# EAGLE board CarPC-CC-Integrated (EAGLE 9.5.2)
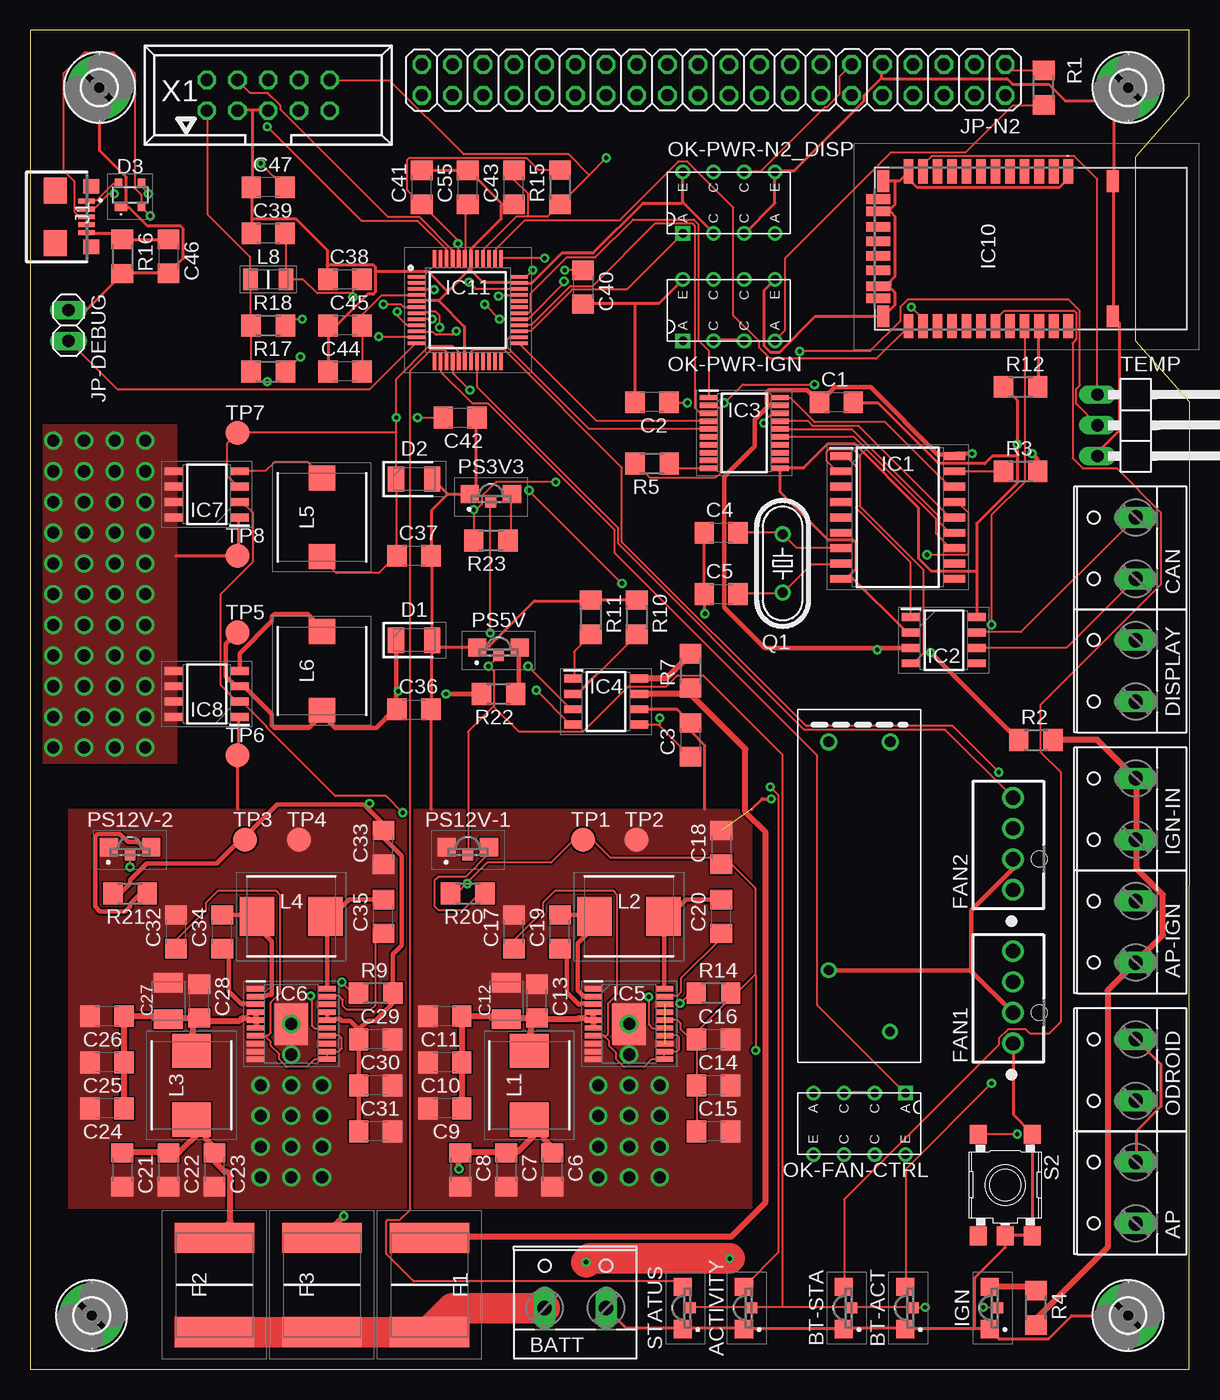
[diagram p6: board, top side]
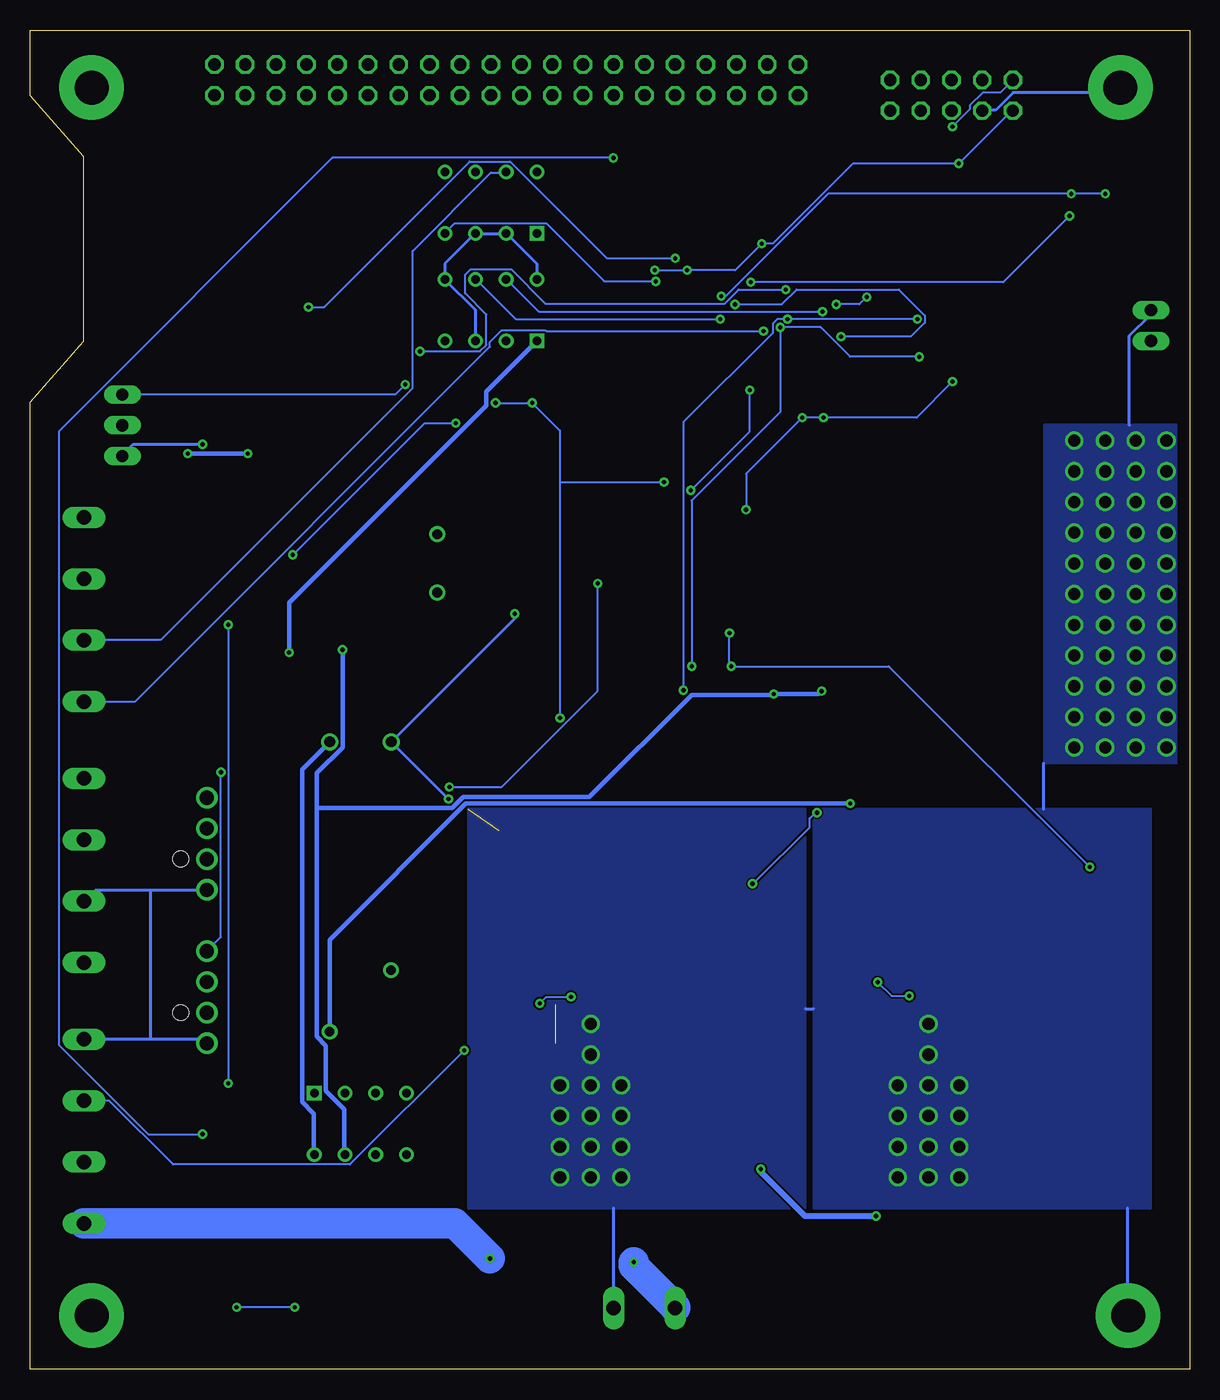
[diagram p7: board, bottom side, seen from below]

Size 95.89 x 110.8 mm. Coordinates in mm from the lower left corner, seen from the top.
Outline: 0,0 95.87,0 95.89,80.01 91.44,85.09 91.44,100.33 95.87,105.39 95.87,110.8 0,110.8 0,0
Copper layers (1*16): Top 0.035mm / dielectric 1.5mm / Bottom 0.035mm
Design rules "default": minimum track width 6mil, minimum drill 0.35mm, track to track 6mil, track to pad 6mil, pad to pad 6mil, via to via 6mil, smd to smd 6mil, copper to edge 40mil, drill to drill 6mil, minimum pad ring 10mil, minimum via ring 8mil, stop-mask expansion 4mil, vias tented up to drill 0mil, thermal gap 10mil
Net classes: 0 default: width 0.127 mm, clearance 0.025 mm; 1 5v Regulated: width 0.381 mm, clearance 0.025 mm; 2 12v Regulated: width 0.381 mm, clearance 0.127 mm; 3 11..14v Ignition: width 0.508 mm, clearance 0.127 mm; 4 11..14v Generator: width 0.508 mm, clearance 0.127 mm; 5 Chassis: width 0.254 mm; 6 0v Isolated: width 0.254 mm; 7 3V3 Arduino: width 0.076 mm, clearance 0.025 mm; 8 5V Signal: width 0.076 mm, clearance 0.025 mm; 9 3V3 Signal: width 0.076 mm, clearance 0.025 mm; 10 11..14v Unfused: width 2.54 mm, clearance 0.254 mm
tKeepout: area 20.3,33.7 to 22.9,41.3; area 48.3,33.7 to 50.8,41.3; area 20.3,68.6 to 27.9,72.4; area 20.3,55.9 to 27.9,59.7; area 69.9,97.2 to 71.1,99.7; area 69.9,85.7 to 71.1,88.3; area 88.9,97.2 to 90.2,99.7; area 88.9,85.7 to 90.2,88.3; area -1.9,50.2 to 12.1,78.1; area 9.5,22.2 to 17.1,24.8; area 37.5,22.2 to 45.1,24.8; area 10.8,4.4 to 37.5,9.5; 1 more areas
bKeepout: area 19.7,68.6 to 27.3,72.4; area 19.7,55.9 to 27.3,59.7; area 69.9,97.2 to 71.1,99.7; area 69.9,85.7 to 71.1,88.3; area 88.9,85.7 to 90.2,88.3; area 88.9,97.2 to 90.2,99.7; area -1.9,50.2 to 12.1,78.1; area 10.8,4.4 to 37.5,9.5; area 43.8,0.6 to 46.4,10.2
tRestrict: area 20.3,66 to 27.9,74.9; area 20.3,53.3 to 27.9,62.2; area -3.2,49.5 to 33.7,49.5; area -3.8,47.6 to 15.2,52.7; area -1.9,75.6 to 14.6,79.4

## Footprints (pad centres in the part's own frame; a part is rotated, then mirrored left to right if it is on the bottom)
INS126ASUW = smd 1.5 x 1.5: 1 -1.75,0.65; 2 1.75,0.65 | smd 0.9 x 0.9: 3 0,0
W237-132 = drill 1.194 long: 1 -2.54,-0.635; 2 2.54,-0.635
C1206 = smd 1.6 x 1.8: 1 -1.4,0; 2 1.4,0
SMC_B = smd 1.6 x 2.4: + -1.5,0; - 1.5,0
DIOC3419X116N = smd 1.35 x 2.1: 1 -1.5,0; 2 1.5,0
PESD2ETHAXR = smd 1 x 0.7: 1 -0.75,-1 | smd 0.6 x 0.7: 2 0.95,-1; 3 0.95,1; 4 -0.95,1
MFGSMF30036X2 = smd 2.5 x 6.6: 1 -3.9,0; 2 3.9,0
47053-1000 = drill 1.17 pad 1.77: 1 1.57,2.54; 2 4.11,2.54; 3 6.65,2.54; 4 9.19,2.54 | hole 1.3: 4.11,0.38
2,8-PAD = drill 2.8 pad 5.334: B2,8 0,0
SOIC127P1030X265-18N = smd 1.85 x 0.65: 1 -4.675,5.08; 2 -4.675,3.81; 3 -4.675,2.54; 4 -4.675,1.27; 5 -4.675,0; 6 -4.675,-1.27; 7 -4.675,-2.54; 8 -4.675,-3.81; 9 -4.675,-5.08; 10 4.675,-5.08; 11 4.675,-3.81; 12 4.675,-2.54; 13 4.675,-1.27; 14 4.675,0; 15 4.675,1.27; 16 4.675,2.54; 17 4.675,3.81; 18 4.675,5.08
SOIC127P600X175-8N = smd 1.528 x 0.65: 1 -2.711,1.905; 2 -2.711,0.635; 3 -2.711,-0.635; 4 -2.711,-1.905; 5 2.711,-1.905; 6 2.711,-0.635; 7 2.711,0.635; 8 2.711,1.905
SOP65P640X120-20N = smd 1.475 x 0.45: 1 -2.938,2.925; 2 -2.938,2.275; 3 -2.938,1.625; 4 -2.938,0.975; 5 -2.938,0.325; 6 -2.938,-0.325; 7 -2.938,-0.975; 8 -2.938,-1.625; 9 -2.938,-2.275; 10 -2.938,-2.925; 11 2.938,-2.925; 12 2.938,-2.275; 13 2.938,-1.625; 14 2.938,-0.975; 15 2.938,-0.325; 16 2.938,0.325; 17 2.938,0.975; 18 2.938,1.625; 19 2.938,2.275; 20 2.938,2.925
SOP65P640X120-21N = smd 1.475 x 0.45: 1 -2.938,2.925; 2 -2.938,2.275; 3 -2.938,1.625; 4 -2.938,0.975; 5 -2.938,0.325; 6 -2.938,-0.325; 7 -2.938,-0.975; 8 -2.938,-1.625; 9 -2.938,-2.275; 10 -2.938,-2.925; 11 2.938,-2.925; 12 2.938,-2.275; 13 2.938,-1.625; 14 2.938,-0.975; 15 2.938,-0.325; 16 2.938,0.325; 17 2.938,0.975; 18 2.938,1.625; 19 2.938,2.275; 20 2.938,2.925 | smd 2.75 x 3.43: 21 0,0
SOIC127P599X173-8N = smd 1.525 x 0.65: 1 -2.712,1.905; 2 -2.712,0.635; 3 -2.712,-0.635; 4 -2.712,-1.905; 5 2.712,-1.905; 6 2.712,-0.635; 7 2.712,0.635; 8 2.712,1.905
RN42HIDIRM = smd 2 x 0.8: 1 -6.4,16; 2 -6.4,14.8; 3 -6.4,13.6; 4 -6.4,12.4; 5 -6.4,11.2; 6 -6.4,10; 7 -6.4,8.8; 8 -6.4,7.6; 9 -6.4,6.4; 10 -6.4,5.2; 11 -6.4,4; 12 -6.4,2.8; 13 6.4,2.8; 14 6.4,4; 15 6.4,5.2; 16 6.4,6.4; 17 6.4,7.6; 18 6.4,8.8; 19 6.4,10; 20 6.4,11.2; 21 6.4,12.4; 22 6.4,13.6; 23 6.4,14.8; 24 6.4,16 | smd 0.8 x 2: 28 3.1,0.3; 29 -3.1,0.3; 30 4.1,0.3; 31 1.8,0.3; 32 0.6,0.3; 33 -0.6,0.3; 34 -1.8,0.3; 35 -4.1,0.3 | smd 1.8 x 1: 36 -5.6,0.7; 37 -5.6,19.7; 38 5.6,0.7; 39 5.6,19.7
QFP50P900X900X120-48N = smd 1.475 x 0.3: 1 -4.238,2.75; 2 -4.238,2.25; 3 -4.238,1.75; 4 -4.238,1.25; 5 -4.238,0.75; 6 -4.238,0.25; 7 -4.238,-0.25; 8 -4.238,-0.75; 9 -4.238,-1.25; 10 -4.238,-1.75; 11 -4.238,-2.25; 12 -4.238,-2.75; 25 4.238,-2.75; 26 4.238,-2.25; 27 4.238,-1.75; 28 4.238,-1.25; 29 4.238,-0.75; 30 4.238,-0.25; 31 4.238,0.25; 32 4.238,0.75; 33 4.238,1.25; 34 4.238,1.75; 35 4.238,2.25; 36 4.238,2.75 | smd 0.3 x 1.475: 13 -2.75,-4.238; 14 -2.25,-4.238; 15 -1.75,-4.238; 16 -1.25,-4.238; 17 -0.75,-4.238; 18 -0.25,-4.238; 19 0.25,-4.238; 20 0.75,-4.238; 21 1.25,-4.238; 22 1.75,-4.238; 23 2.25,-4.238; 24 2.75,-4.238; 37 2.75,4.238; 38 2.25,4.238; 39 1.75,4.238; 40 1.25,4.238; 41 0.75,4.238; 42 0.25,4.238; 43 -0.25,4.238; 44 -0.75,4.238; 45 -1.25,4.238; 46 -1.75,4.238; 47 -2.25,4.238; 48 -2.75,4.238
DX4R005HJ5 = smd 0.4 x 1.35: 1 2.41,-0.429; 2 3.06,-0.429; 3 3.71,-0.429; 4 4.36,-0.429; 5 5.01,-0.429 | smd 1.2 x 1.3: 6 6.21,-0.029; 7 1.21,-0.029 | smd 2.15 x 1.9: 8 1.535,-3.029; 9 5.885,-3.029
1X02 = drill 1.016 long: 1 -1.27,0; 2 1.27,0
2X20 = drill 1.016 octagon: 1 -24.13,-1.27; 2 -24.13,1.27; 3 -21.59,-1.27; 4 -21.59,1.27; 5 -19.05,-1.27; 6 -19.05,1.27; 7 -16.51,-1.27; 8 -16.51,1.27; 9 -13.97,-1.27; 10 -13.97,1.27; 11 -11.43,-1.27; 12 -11.43,1.27; 13 -8.89,-1.27; 14 -8.89,1.27; 15 -6.35,-1.27; 16 -6.35,1.27; 17 -3.81,-1.27; 18 -3.81,1.27; 19 -1.27,-1.27; 20 -1.27,1.27; 21 1.27,-1.27; 22 1.27,1.27; 23 3.81,-1.27; 24 3.81,1.27; 25 6.35,-1.27; 26 6.35,1.27; 27 8.89,-1.27; 28 8.89,1.27; 29 11.43,-1.27; 30 11.43,1.27; 31 13.97,-1.27; 32 13.97,1.27; 33 16.51,-1.27; 34 16.51,1.27; 35 19.05,-1.27; 36 19.05,1.27; 37 21.59,-1.27; 38 21.59,1.27; 39 24.13,-1.27; 40 24.13,1.27
INDM7366X300N = smd 2.85 x 3.2: 1 -2.85,0; 2 2.85,0
INDPM7373X500N = smd 2.05 x 2.2: 1 -3.25,0; 2 3.25,0
INDC3216X130N = smd 1.2 x 1.8: 1 -1.45,0; 2 1.45,0
FPR_ILD74 = drill 0.7 square: P$1 -2.54,5.08 | drill 0.7: P$2 -2.54,2.54; P$3 -2.54,0; P$4 -2.54,-2.54; P$5 2.54,-2.54; P$6 2.54,0; P$7 2.54,2.54; P$8 2.54,5.08
HC49/S = drill 0.813: 1 -2.413,0; 2 2.413,0
R1206 = smd 1.6 x 1.803: 1 -1.422,0; 2 1.422,0
SKHMPXE010 = smd 1.6 x 1.4: 1 -4.2,2.25; 2 4.2,2.25; 3 -4.2,-2.25; 4 4.2,-2.25; 5 4.2,0
1X03/90 = drill 1.016 long: 1 -2.54,-3.81; 2 0,-3.81; 3 2.54,-3.81
TP20R = smd 2 x 2: TP 0,0
FPR_JS-MN-KT = drill 0.9: A 18.9,5.08; B 18.9,0 | drill 0.8: COM -5.08,0; NO 0,5.08
057-010-1 = drill 1 octagon: 1 -5.08,-1.27; 2 -5.08,1.27; 3 -2.54,-1.27; 4 -2.54,1.27; 5 0,-1.27; 6 0,1.27; 7 2.54,-1.27; 8 2.54,1.27; 9 5.08,-1.27; 10 5.08,1.27

## Placement (x,y rotation side)
ACTIVITY  IN-S126ASUW  [INS126ASUW]  59.69,5.08 90 top
AP  [W237-132]  90.81,14.61 90 top
AP-IGN  [W237-132]  90.81,36.2 90 top
BATT  [W237-132]  45.09,5.71 0 top
BT-ACT  IN-S126ASUW  [INS126ASUW]  73.03,5.08 90 top
BT-STA  IN-S126ASUW  [INS126ASUW]  67.95,5.08 90 top
C1  100nF  [C1206]  66.68,80.01 0 top
C2  100nF  [C1206]  51.43,80.01 180 top
C3  100nF  [C1206]  54.61,52.07 270 top
C4  22pF  [C1206]  57.15,69.22 0 top
C5  22pF  [C1206]  57.15,64.14 0 top
C6  0.1µF  [C1206]  43.18,16.51 270 top
C7  10µF  [C1206]  39.37,16.51 270 top
C8  10µF  [C1206]  35.56,16.51 270 top
C9  10µF  [C1206]  34.29,21.59 180 top
C10  10µF  [C1206]  34.29,25.4 180 top
C11  0.1µF  [C1206]  34.29,29.21 180 top
C12  100µF  [SMC_B]  39.37,30.48 90 top
C13  0.47µF  [C1206]  41.91,30.48 90 top
C14  10µF  [C1206]  56.52,23.5 180 top
C15  10µF  [C1206]  56.52,19.69 180 top
C16  2.2µF  [C1206]  56.52,27.3 180 top
C17  4.7µF  [C1206]  40,36.2 90 top
C18  0.1µF  [C1206]  57.15,43.18 270 top
C19  0.1µF  [C1206]  43.81,36.2 90 top
C20  0.1µF  [C1206]  57.15,37.47 90 top
C21  0.1µF  [C1206]  7.62,16.51 270 top
C22  10µF  [C1206]  11.43,16.51 270 top
C23  10µF  [C1206]  15.24,16.51 270 top
C24  10µF  [C1206]  6.35,21.59 180 top
C25  10µF  [C1206]  6.35,25.4 180 top
C26  0.1µF  [C1206]  6.35,29.21 180 top
C27  100µF  [SMC_B]  11.43,30.48 90 top
C28  0.47µF  [C1206]  13.97,30.48 90 top
C29  10µF  [C1206]  28.58,27.3 180 top
C30  10µF  [C1206]  28.58,23.5 180 top
C31  2.2µF  [C1206]  28.58,19.69 180 top
C32  4.7µF  [C1206]  12.06,36.2 90 top
C33  0.1µF  [C1206]  29.21,43.18 90 top
C34  0.1µF  [C1206]  15.88,36.2 90 top
C35  0.1µF  [C1206]  29.21,37.47 90 top
C36  220µF  [C1206]  31.75,54.61 0 top
C37  220µF  [C1206]  31.75,67.31 0 top
C38  100nF  [C1206]  26.04,90.17 180 top
C39  10µF  [C1206]  19.69,93.98 180 top
C40  100nF  [C1206]  45.72,89.53 270 top
C41  100nF  [C1206]  32.38,97.79 90 top
C42  100nF  [C1206]  35.56,78.74 0 top
C43  100nF  [C1206]  40,97.79 90 top
C44  4.7µF  [C1206]  26.04,82.55 180 top
C45  100nF  [C1206]  26.04,86.36 180 top
C46  47nF 1kV  [C1206]  11.43,92.08 270 top
C47  10µF  [C1206]  19.69,97.79 180 top
C55  1µF  [C1206]  36.2,97.79 90 top
CAN  [W237-132]  90.81,67.95 90 top
D1  CD1206-B260  [DIOC3419X116N]  31.75,60.33 0 top
D2  CD1206-B260  [DIOC3419X116N]  31.75,73.66 0 top
D3  PRTR5V0U2AX,235  [PESD2ETHAXR]  8.26,97.16 0 top
DISPLAY  [W237-132]  90.81,57.78 90 top
F1  MF-GSMF300_36X-2  [MFGSMF30036X2]  33.02,6.99 270 top
F2  MF-GSMF300_36X-2  [MFGSMF30036X2]  15.24,6.99 90 top
F3  MF-GSMF300_36X-2  [MFGSMF30036X2]  24.13,6.99 90 top
FAN1  47053-1000  [47053-1000]  83.82,25.4 90 top
FAN2  47053-1000  [47053-1000]  83.82,38.1 90 top
H1  MOUNT-PAD-ROUND2.8  [2,8-PAD]  5.08,4.44 0 top
H2  MOUNT-PAD-ROUND2.8  [2,8-PAD]  90.81,4.44 0 top
H3  MOUNT-PAD-ROUND2.8  [2,8-PAD]  90.81,106.05 0 top
H4  MOUNT-PAD-ROUND2.8  [2,8-PAD]  5.71,106.05 0 top
IC1  MCP2515-I_SO  [SOIC127P1030X265-18N]  71.76,70.48 0 top
IC2  TJA1050T_CM,118  [SOIC127P600X175-8N]  75.57,60.33 0 top
IC3  TXS0108EPWR  [SOP65P640X120-20N]  59.05,77.47 0 top
IC4  INA219AIDR  [SOIC127P600X175-8N]  47.62,55.24 0 top
IC5  TPS55165QPWPRQ1  [SOP65P640X120-21N]  49.53,28.58 0 top
IC6  TPS55165QPWPRQ1  [SOP65P640X120-21N]  21.59,28.58 0 top
IC7  MIC4680-3.3YM  [SOIC127P599X173-8N]  14.61,72.39 180 top
IC8  MIC4680-5.0YM-TR  [SOIC127P599X173-8N]  14.61,55.88 180 top
IC10  RN42HID-I_RM  [RN42HIDIRM]  69.85,92.71 270 top
IC11  [QFP50P900X900X120-48N]  36.2,87.63 0 top
IGN  IN-S126ASUW  [INS126ASUW]  80.01,5.08 90 top
IGN-IN  [W237-132]  90.81,46.36 90 top
J1  DX4R005HJ5R2000  [DX4R005HJ5]  5.08,99.06 270 top
JP-DEBUG  [1X02]  3.17,86.36 270 top
JP-N2  [2X20]  56.52,106.68 180 top
L1  SRP7028A-2R2M  [INDM7366X300N]  41.27,23.5 90 top
L2  SRP7028A-4R7M  [INDM7366X300N]  49.53,37.47 0 top
L3  SRP7028A-2R2M  [INDM7366X300N]  13.33,23.5 90 top
L4  SRP7028A-4R7M  [INDM7366X300N]  21.59,37.47 0 top
L5  B1047AS-680M=P3  [INDPM7373X500N]  24.13,70.48 90 top
L6  B1047AS-680M=P3  [INDPM7373X500N]  24.13,57.78 90 top
L8  742792122  [INDC3216X130N]  19.69,90.17 0 top
ODROID  [W237-132]  90.81,24.77 90 top
OK-FAN-CTRL  ILD74  [FPR_ILD74]  67.31,20.32 270 top
OK-PWR-IGN  ILD74  [FPR_ILD74]  59.05,87.63 90 top
OK-PWR-N2_DISP  ILD74  [FPR_ILD74]  59.05,96.52 90 top
PS3V3  IN-S126ASUW  [INS126ASUW]  38.1,71.75 0 top
PS5V  IN-S126ASUW  [INS126ASUW]  38.73,59.06 0 top
PS12V-1  IN-S126ASUW  [INS126ASUW]  36.2,42.55 0 top
PS12V-2  IN-S126ASUW  [INS126ASUW]  8.26,42.55 0 top
Q1  16MHz  [HC49/S]  62.23,66.67 90 top
R1  1k  [R1206]  83.82,106.05 270 top
R2  1k  [R1206]  83.19,52.07 180 top
R3  10K  [R1206]  81.92,74.3 180 top
R4  1k  [R1206]  83.19,5.08 270 top
R5  10k  [R1206]  51.43,74.93 0 top
R7  100k  [R1206]  54.61,57.78 90 top
R9  100k  [R1206]  28.58,31.12 0 top
R10  10k  [R1206]  50.16,62.23 90 top
R11  10k  [R1206]  46.35,62.23 90 top
R12  10k  [R1206]  81.92,81.28 180 top
R14  100k  [R1206]  56.52,31.12 0 top
R15  100k  [R1206]  43.81,97.79 90 top
R16  1M  [R1206]  7.62,92.08 90 top
R17  4.7k  [R1206]  19.69,82.55 180 top
R18  4.7k  [R1206]  19.69,86.36 180 top
R20  1k  [R1206]  36.2,39.37 180 top
R21  1k  [R1206]  8.26,39.37 180 top
R22  330R  [R1206]  38.73,55.88 180 top
R23  270R  [R1206]  38.1,68.58 180 top
S2  SKHMPSE010  [SKHMPXE010]  80.65,15.24 270 top
STATUS  IN-S126ASUW  [INS126ASUW]  54.61,5.08 90 top
TEMP  [1X03/90]  92.08,78.11 270 top
TP1  TPTP20R  [TP20R]  45.72,43.81 0 top
TP2  TPTP20R  [TP20R]  50.16,43.81 0 top
TP3  TPTP20R  [TP20R]  17.78,43.81 0 top
TP4  TPTP20R  [TP20R]  22.23,43.81 0 top
TP5  TPTP20R  [TP20R]  17.15,60.96 0 top
TP6  TPTP20R  [TP20R]  17.15,50.8 0 top
TP7  TPTP20R  [TP20R]  17.15,77.47 0 top
TP8  TPTP20R  [TP20R]  17.15,67.31 0 top
U$4  JS-MN-KT  [FPR_JS-MN-KT]  71.12,33.02 90 top
X1  057-010-1  [057-010-1]  19.69,105.41 0 top

## Tracks (layer width: path | path; a pad name or v marks a point on that pad's centre or on a via)
0V
  Top 0.254: OK-FAN-CTRL.P$3 67.31,22.89 69.83,22.89 OK-FAN-CTRL.P$2
+3V3  (via drill 0.35)
  Top 0.152: IC7.3 17.25,73.03 16.56,73.71 16.48,73.71 16.26,73.94 16.26,76.61 17.09,77.45 TP7.TP 17.17,77.52 30.28,77.52 | 30.28,77.52 30.28,73.71 D2.1 30.28,73.64 30.28,67.31 | 30.28,77.52 v30.28,78.74 30.28,81.94 33.02,84.68 34.92,84.68 35.38,84.23 35.38,83.46 IC11.17 | v32.03,78.74 C42.1 | R23.2 36.68,68.61 v36.68,71.12 36.91,71.12 37.36,71.58 37.36,72.26 38.51,73.41 v43.46,73.41 | 30.28,67.31 28.83,65.86 25.32,65.86 24.18,67 24.18,67.23 L5.1 | 30.28,67.31 C37.1 | v41.55,90.93 41.02,90.4 40.49,90.4 IC11.36 | v44.22,90.93 45.67,90.93 C40.1 | IC11.44 35.38,91.92 v35.38,93.14 35.38,93.37 32.41,96.34 C41.1 32.33,96.42 31.19,97.56 31.19,100.08 31.34,100.23 41.02,100.23 42.01,99.24 43.76,99.24 R15.2 | 18.24,86.36 L8.1 18.16,90.17 18.16,92.08 14.66,95.58 14.66,104.11 X1.1 | 18.24,86.36 18.24,82.55 R17.2 18.31,82.55 19.15,81.71 v19.61,81.71 | 18.24,86.36 R18.2 | v19.08,99.77 21.06,97.79 C47.1 | TEMP.1 88.27,98.48 86.36,100.38 74.55,100.38 73.86,99.7 73.86,99.16 IC10.11 | 52.03,53.25 54.59,50.7 C3.2 | 52.03,53.25 51.99,53.29 50.39,53.29 IC4.5 | 56.98,79.54 57.1,79.43 57.1,74.17 56.72,73.79 51.23,73.79 50.09,74.93 R5.1 | 56.98,79.54 56.79,79.73 56.18,79.73 IC3.2 | v54.36,79.96 52.91,79.96 C2.1 | 56.98,79.54 v57.4,79.96 58.93,81.48 v64.87,81.48 | v52.07,53.9 52.07,53.29 52.03,53.25
  Bottom 0.152: v36.68,71.12 36.68,74.09 v32.03,78.74 v30.28,78.74 22.58,78.74 v19.61,81.71 | v44.22,90.93 v41.55,90.93 37.59,90.93 v35.38,93.14 34.47,93.14 27.84,99.77 v19.08,99.77 14.66,104.19 X1.1 | v57.4,79.96 v54.36,79.96 52.07,77.67 52.07,73.41 | 52.07,73.41 v52.07,53.9 | TEMP.1 65.71,80.64 v64.87,81.48 | 52.07,73.41 v43.46,73.41
+5V  (via drill 0.35)
  Top 0.381: TP5.TP 16.18,60 16.18,57.33 16.94,56.57 17.25,56.57 IC8.3 17.48,56.41 17.78,56.41 19.99,54.2 19.99,53.29 20.22,53.06 23.04,53.06 24.03,54.05 L6.1 24.18,54.51 24.18,54.13 25.25,53.06 28.6,53.06 30.12,54.59 C36.1 30.28,54.66 30.28,56.11 | 30.28,56.11 30.28,60.3 D1.1 | v34.39,55.88 R22.2 | v30.43,56.11 30.28,56.11 | v82.86,75.77 83.31,75.31 83.31,74.32 R3.1 | v77.9,75.77 76.61,75.77 76.45,75.62 IC1.18 76.3,75.69 75.08,75.69 69.52,81.25 66.55,81.25 65.41,80.11 C1.1 65.25,80.03 64.26,81.03 61.14,81.03 60.91,80.8 60.91,79.96 61.06,79.81 | 61.06,79.81 61.98,79.81 IC3.19 | 70.05,59.69 60.76,59.69 57.4,63.04 57.4,73.86 59.92,76.38 59.92,78.59 60.98,79.65 61.06,79.81 | 70.05,59.69 IC2.3 | v70.05,59.54 70.05,59.69
  Bottom 0.381: v30.43,56.11 30.66,55.88 v34.39,55.88 34.54,55.8 41.17,55.8 49.63,47.35 60.07,47.35 60.98,46.43 72.19,46.43 | v77.9,75.77 v82.86,75.77 | 72.19,46.43 72.19,49.33 70.05,51.46 v70.05,59.54 | 72.19,46.43 72.19,27.53 71.43,26.77 71.43,23.04 69.9,21.51 69.9,17.78 OK-FAN-CTRL.P$7
+12V/1  (via drill 0.35)
  Top 0.152: IC7.2 17.32,71.73 17.55,71.73 18.39,70.89 18.39,66.78 15.72,64.11 15.72,56.64 17.09,55.27 17.25,55.27 IC8.2 17.32,55.19 17.55,55.19 19.53,53.21 19.53,53.14 25.25,47.42 29.44,47.42 v30.81,46.05 | 36.11,40.22 37.82,41.94 43.08,41.94 44.91,43.76 45.67,43.76 TP1.TP 45.74,43.76 46.58,43.76 48.03,42.32 56.57,42.32 57.1,41.78 C18.2 57.17,41.71 58.09,41.71 59.99,39.8 59.99,32.72 59.96,32.68 | 36.11,40.22 35.31,39.42 34.85,39.42 R20.2 | C14.2 C15.2 | IC5.17 52.45,29.52 52.45,28.91 IC5.16 52.53,28.91 53.52,28.91 53.82,28.6 53.82,28.14 54.66,27.3 C16.2 | C16.2 C14.2 | C14.2 | 59.96,32.68 58.39,31.12 R14.2 57.86,31.12 57.86,30.66 55.12,27.91 C16.2 | v59.99,26.39 59.99,32.64 59.96,32.68 | v36.14,40.18 36.11,40.22
  Bottom 0.152: v59.99,26.39 69.44,16.94 84.07,16.94 89.33,22.2 91.39,22.2 ODROID.1 | v30.81,46.05 30.96,46.05 31.42,45.59 31.42,44.83 36.07,40.18 v36.14,40.18
+12V/2  (via drill 0.35)
  Top 0.381: C31.2 27.15,19.69 27.15,23.5 C30.2 27.15,23.65 27.15,27.15 C29.2 27.23,27.3 27.23,28.07 27.19,28.11 | IC6.17 24.56,29.52 24.56,28.91 IC6.16 24.71,28.91 25.17,28.91 25.25,28.98 25.63,28.98 25.78,28.83 26.47,28.83 27.19,28.11 | 27.19,28.11 27.92,28.83 28.52,28.83 29.97,30.28 29.97,31.12 R9.2 29.97,31.27 29.97,34.31 30.73,35.08 30.73,42.47 29.29,43.92 29.29,44.45 C33.2 29.21,45.14 27.8,46.55 | 27.8,46.55 27.61,46.74 20.45,46.74 17.78,44.07 TP3.TP 17.63,43.76 17.32,43.76 15.42,41.86 9.63,41.86 8.26,40.49 8.26,40.18 7.49,39.42 6.88,39.42 R21.2 | 27.8,46.55 v28.07,46.81
  Bottom 0.381: U$4.COM 71.12,35.54 59.84,46.81 v28.07,46.81
A0-DAC0/THERM-VO-SENS  (via drill 0.35)
  Top 0.152: v33.4,89.33 32.03,89.33 IC11.3 | v63.65,84.23 69.44,84.23 71.96,86.74 71.96,87.88 72.57,88.49 85.9,88.49 86.82,87.58 86.82,81.41 86.51,81.1 86.51,79.88 88.27,78.13 TEMP.2
  Bottom 0.152: v33.4,89.33 37.29,89.33 38.43,88.19 53.29,88.19 56.11,91.01 59.46,91.01 59.92,90.55 59.92,89.03 58.17,87.27 58.17,84.76 58.7,84.23 v63.65,84.23
A2/ACT-LED  (via drill 0.35)
  Top 0.152: v36.37,81.03 35,82.4 35,83.39 IC11.16 | v48.95,65.02 v41.25,72.72 | v61.21,48.18 61.9,47.5 61.9,9.7 59.08,6.88 ACTIVITY.2
  Bottom 0.152: v36.37,81.03 36.37,77.6 v41.25,72.72 | v48.95,65.02 48.95,56.11 56.87,48.18 v61.21,48.18
A3/STATUS-LED
  Top 0.152: IC11.15 34.39,83.46 34.39,84.23 34.24,84.38 33.17,84.38 31.42,82.63 31.42,13.21 30.58,12.37 29.59,12.37 29.44,12.22 29.44,9.55 31.73,7.26 53.52,7.26 53.9,6.88 STATUS.2
A4/SDA  (via drill 0.35)
  Top 0.152: v33.86,86.21 33.86,87.2 33.55,87.5 32.94,87.5 32.87,87.43 32.03,87.43 IC11.7 | v22.35,83.77 21.13,82.55 R17.1 | v41.17,58.17 44.68,54.66 44.91,54.66 IC4.3
  Bottom 0.152: v22.35,83.77 28.07,83.77 30.51,86.21 v33.86,86.21 33.86,79.2 41.17,71.88 v41.17,58.17
A5/SCL  (via drill 0.35)
  Top 0.152: v33.25,86.89 32.03,86.89 IC11.8 | v22.5,86.89 21.67,86.89 21.13,86.36 R18.1 | v41.86,56.19 44.68,53.37 44.91,53.37 IC4.4
  Bottom 0.152: v22.5,86.89 v33.25,86.89 34.09,86.89 34.47,86.51 34.47,85.75 41.86,78.36 v41.86,56.19
A6/FAN-RLS-CTRL
  Top 0.152: IC11.14 34.01,83.39 34.01,82.47 36.6,79.88 37.9,79.88 48.34,69.44 48.34,67.54 65.1,50.77 65.1,30.12 72.34,22.89 OK-FAN-CTRL.P$1
AREF
  Top 0.152: 27.46,86.36 27.46,87.27 29.06,88.88 IC11.4 | 27.46,86.36 27.46,82.55 C44.1 | 27.46,86.36 C45.1
BATT-F  (via drill 0.35)
  Top 0.508: C6.1 43.16,17.93 43.16,18.39 42.47,19.07 42.47,19.46 41.33,20.6 L1.1 42.01,19.69 40.34,18.01 39.57,18.01 C7.1 39.34,17.93 35.61,17.93 C8.1 35.46,17.7 v35.46,16.56 | v25.93,12.68 24.18,10.92 F3.2
  Bottom 0.508: v35.46,16.56 35.46,16.33 31.8,12.68 v25.93,12.68
BATT-F1
  Top 0.508: C21.1 7.64,17.93 11.38,17.93 C22.1 11.68,17.93 12.29,17.93 14.05,19.69 L3.1 13.36,20.6 14.5,19.46 14.5,19.07 15.19,18.39 15.19,17.93 C23.1 15.34,17.7 15.34,17.09 16.1,16.33 16.33,16.33 16.56,16.1 16.56,12.22 15.27,10.92 F2.2
BATT-IN  (via drill 0.35)
  Top 2.54: F2.1 15.27,3.07 24.11,3.07 F3.1 25.4,3.07 31.8,3.07 F1.2 33.02,3.15 34.92,5.05 42.54,5.05 BATT.1 | v57.86,9.17 46.28,9.17 v45.97,8.86
  Bottom 2.54: AP.1 60.76,12.07 v57.86,9.17 | v45.97,8.86 45.97,8.56 42.54,5.13 BATT.1
BATT-IN-FUSED
  Top 0.508: IC4.7 54.13,55.88 54.59,56.34 R7.1 54.51,55.96 59.16,51.31 59.16,46.13 60.83,44.45 60.83,13.82 58.01,11 33.1,11 33.02,10.92 F1.1
BST1
  Top 0.381: IC5.3 46.58,30.2 45.97,30.2 45.9,30.28 45.52,30.28 45.44,30.2 45.36,30.2 44.37,31.19 44.37,34.24 43.84,34.77 C19.1
BST1-2
  Top 0.381: IC6.3 18.62,30.2 18.01,30.2 17.93,30.28 17.55,30.28 17.48,30.2 16.41,31.27 16.41,34.24 15.88,34.77 C34.1
BST2
  Top 0.152: IC5.19 52.53,30.89 53.52,30.89 53.82,31.19 53.82,32.33 57.1,35.61 57.1,35.99 C20.1
BST2-2
  Top 0.152: IC6.19 24.56,30.89 25.55,30.89 25.86,30.58 25.86,30.05 26.16,29.74 28.14,29.74 28.52,30.12 28.52,35.31 29.21,35.99 C35.1
BT-ACTIVATE
  Top 0.254: R12.1 83.39,81.33 83.39,86.28 IC10.22
BT-LED-ACT  (via drill 0.35)
  Top 0.152: v79.5,23.65 72.42,16.56 72.42,6.88 BT-ACT.2 | v79.5,61.59 79.5,70.66 82.25,73.41 82.25,86.28 IC10.21
  Bottom 0.152: v79.5,61.59 v79.5,23.65
BT-LED-STA
  Top 0.152: BT-STA.2 67.31,6.88 67.31,14.05 80.11,26.85 80.11,27.38 80.87,28.14 82.32,28.14 82.7,27.76 84.23,27.76 85.22,28.75 85.22,49.4 83.54,51.08 83.54,54.97 93.52,64.95 93.52,70.89 89.87,74.55 87.05,74.55 86.21,75.39 86.21,84.91 86.51,85.22 86.51,87.43 86.36,87.58 80.57,87.58 79.88,86.89 79.88,86.36 IC10.19
BT-RX
  Top 0.152: IC11.38 38.51,91.92 38.51,92.69 40.87,95.05 48.72,95.05 53.59,99.92 54.36,99.92 58.17,96.11 58.17,87.2 60.3,85.06 60.3,84.53 61.21,83.62 69.98,83.62 72.64,86.28 IC10.13
BT-TX  (via drill 0.35)
  Top 0.152: v42.54,91.92 38.96,91.92 IC11.37 | v72.87,87.88 73.79,86.97 73.79,86.36 IC10.14
  Bottom 0.152: v42.54,91.92 48.18,91.92 56.18,99.92 59.54,99.92 71.58,87.88 v72.87,87.88
CAN-H
  Top 0.152: CAN.2 81.94,60.98 78.28,60.98 IC2.7
CAN-L
  Top 0.152: IC2.6 85.67,59.69 91.39,65.41 CAN.1
D4/SW-DEBUG
  Top 0.152: IC11.12 31.95,84.84 31.8,84.84 28.07,81.1 7.19,81.1 3.23,85.06 JP-DEBUG.2
D5/DISP-BRIGHT  (via drill 0.35)
  Top 0.152: v35.23,85.9 34.92,85.6 33.55,85.6 33.32,85.83 32.03,85.83 IC11.10
  Bottom 0.152: v35.23,85.9 53.21,85.9 53.29,85.98 56.87,85.98 57.86,84.99 57.86,84.61 87.2,55.27 91.39,55.27 DISPLAY.1
D6/IGN-SENS  (via drill 0.35)
  Top 0.152: v30.35,87.5 30.35,87.2 31.12,86.44 31.95,86.44 IC11.9
  Bottom 0.152: v30.35,87.5 53.82,87.5 56.49,90.17 OK-PWR-IGN.P$7
D7/ODROID-PWR-SENS  (via drill 0.35)
  Top 0.152: v28.83,85.45 31.95,85.45 IC11.11 | v38.81,86.89 v37.59,88.11
  Bottom 0.152: v28.83,85.45 23.04,85.45 21.9,86.59 21.9,87.2 24.03,89.33 32.49,89.33 33.71,88.11 v37.59,88.11 | v38.81,86.89 55.73,86.89 59,90.17 OK-PWR-IGN.P$6
D8/DISP-PWR-BTN-CTRL
  Top 0.152: OK-PWR-N2_DISP.P$1 49.33,89.33 44.83,89.33 41.4,85.9 40.49,85.9 IC11.27
D9/ODROID-PWR-BTN-CTRL  (via drill 0.35)
  Top 0.152: v44.14,90.02 44.14,89.86 41.17,86.89 40.49,86.89 IC11.29
  Bottom 0.152: v44.14,90.02 48.41,90.02 53.21,94.82 60.76,94.82 OK-PWR-N2_DISP.P$4
D10/SPI-CS-3V3
  Top 0.152: IC3.1 56.11,80.42 56.11,84.3 55.27,85.14 55.27,94.74 54.89,95.12 49.86,95.12 46.74,92 44.37,92 41.4,89.03 41.4,87.58 41.25,87.43 40.49,87.43 IC11.30
D11/SPI-MOSI-3V3
  Top 0.152: IC3.4 56.11,78.51 46.81,78.51 40.49,84.84 IC11.25
D12/SPI-MISO-3V3
  Top 0.152: IC3.3 56.11,79.12 55.42,79.12 54.97,79.58 54.97,94.59 54.74,94.82 51.69,94.82 46.51,89.64 44.68,89.64 41.48,86.44 40.49,86.44 IC11.28
D13/SPI-SCK-3V3
  Top 0.152: IC3.5 56.11,77.83 46.2,77.83 39.42,84.61 39.42,85.14 39.65,85.37 40.41,85.37 IC11.26
DISP-PWR-BTN
  Bottom 0.152: OK-PWR-N2_DISP.P$7 56.57,99.01 57.78,99.01 64.26,92.53 64.26,81.18 85.07,60.38 91.39,60.38 DISPLAY.2
FAN-12V
  Top 0.381: 77.75,33.02 U$4.NO | 77.75,33.02 81.26,29.52 FAN1.2 | FAN2.2 81.26,42.16 81.26,41.4 77.83,37.97 77.83,33.17 77.75,33.02
FAN-RLS-TRIG
  Bottom 0.381: OK-FAN-CTRL.P$8 72.42,17.78 72.42,21.13 73.41,22.12 73.41,49.63 U$4.B
FB-3V3
  Top 0.152: IC7.4 17.32,74.32 19.46,74.32 20.22,75.08 22.96,75.08 24.11,73.94 24.11,73.79 L5.2
FB-5V
  Top 0.381: IC8.4 17.32,59.23 19.99,61.9 19.99,62.28 20.22,62.51 22.96,62.51 24.11,61.37 24.11,61.06 L6.2
GND  (via drill 0.35, 1)  (2 unrouted)
  Top 0.254: AP.2 91.47,17.17 91.47,19.69 93.52,21.74 93.52,25.25 91.47,27.3 ODROID.2 | FAN1.1 81.33,26.92 81.33,21.06 82.86,19.53 S2.1 82.93,19.38 82.93,11.15 S2.2 82.86,11.07 80.65,11.07 S2.5 80.65,10.08 78.13,7.57 78.13,3.38 | 78.13,3.38 72.49,3.38 BT-ACT.1 72.34,3.38 67.31,3.38 BT-STA.1 67.23,3.38 59.16,3.38 ACTIVITY.1 59,3.38 53.98,3.38 STATUS.1 53.9,3.45 49.25,3.45 BATT.2 | 78.13,3.38 79.35,3.38 IGN.1 79.43,3.23 80.11,2.54 84.23,2.54 86.13,4.44 H2.B2,8 | IC2.2 72.8,60.98 72.49,60.98 67.84,65.63 IC1.9 67.46,65.41 68.3,66.24 68.3,68.38 68.07,68.61 66.02,68.61 62.05,72.57 62.05,74.47 IC3.11 62.13,74.55 63.96,74.55 65.94,76.53 68.22,76.53 73.48,71.27 73.48,67.08 74.55,66.02 78.28,66.02 | 78.28,66.02 78.28,69.98 81.64,73.33 81.64,75.54 | 78.28,66.02 78.28,62.28 IC2.8 | 81.64,75.54 v81.64,76.53 81.64,80.19 80.57,81.25 R12.2 | 81.64,75.54 79.58,75.54 78.97,74.93 75.16,74.93 70.13,79.96 68.15,79.96 C1.2 | TEMP.3 88.27,75.84 90.09,77.67 90.09,86.59 89.64,87.05 IC10.39 89.56,87.12 89.56,98.25 IC10.37 89.64,98.4 89.64,104.88 H3.B2,8 89.56,104.95 85.6,104.95 84.23,106.32 81.26,106.32 80.8,106.78 70.51,106.78 70.43,106.86 | 71.5,98.32 71.88,98.32 72.64,99.08 IC10.12 72.42,98.7 73.33,97.79 85.14,97.79 85.83,98.48 85.83,99.08 IC10.1 | 71.5,98.32 70.59,98.32 IC10.36 | 71.5,98.32 71.5,96.34 71.04,95.89 70.21,95.89 IC10.29 71.12,95.81 71.5,95.43 71.5,90.4 71.12,90.02 71.12,89.64 IC10.28 70.21,89.56 71.04,89.56 71.5,89.1 71.5,88.04 70.59,87.12 IC10.38 70.43,87.12 64.95,87.12 61.98,84.15 61.21,84.15 60.68,84.68 60.68,89.26 OK-PWR-IGN.P$5 | 50.01,88.19 51.99,88.19 OK-PWR-IGN.P$8
  Top 0.254: 50.01,88.19 45.74,88.19 C40.2 | 50.01,88.19 50.01,80.03 C2.2 | OK-PWR-IGN.P$2 56.57,85.14 59,85.14 OK-PWR-IGN.P$3 | 53.98,96.57 OK-PWR-N2_DISP.P$8 | 53.98,96.57 56.57,93.98 OK-PWR-N2_DISP.P$2 | OK-PWR-N2_DISP.P$3 59.08,93.98 61.59,96.5 OK-PWR-N2_DISP.P$5 61.67,99.16 63.2,99.16 68.99,104.95 68.99,105.41 70.43,106.86 | 70.43,106.86 70.43,107.92 JP-N2.9 | C41.2 32.41,99.16 36.14,99.16 C55.2 36.3,99.16 39.04,96.42 | 39.04,96.42 39.95,96.42 C43.1 | 33.78,88.42 32.03,88.42 IC11.5 | 36.37,91.01 36.45,91.08 36.45,91.85 IC11.42 36.45,91.92 36.45,92.69 38.96,95.2 38.96,96.34 39.04,96.42 | 36.37,91.01 34.54,89.18 | 34.54,89.18 33.78,88.42 | 33.78,88.42 35.92,86.28 35.92,83.46 IC11.18 | 36.37,91.01 37.44,89.94 40.41,89.94 IC11.35 40.56,89.86 41.48,89.86 43.99,92.38 46.58,92.38 50.7,96.5 53.9,96.5 53.98,96.57 | 18.39,104.19 19.69,104.19 X1.5 | 18.39,104.19 17.17,104.19 X1.3 | C44.2 C45.2 24.71,86.44 25.4,86.44 27.92,88.95 28.37,88.95 28.52,89.1 28.52,90.86 | 18.31,95.2 18.31,97.79 C47.2 18.39,97.87 18.39,104.19 | 18.31,95.2 18.31,93.98 C39.2 | 24.56,91.39 24.56,92.61 21.97,95.2 18.31,95.2 | 24.56,91.39 24.56,90.17 C38.2 | 28.52,90.86 28.52,91.24 28.37,91.39 24.56,91.39 | 34.54,89.18 32.87,90.86 28.52,90.86 | 34.54,72.42 36.3,72.42 PS3V3.1 36.37,72.49 36.91,73.03 36.91,78.74 C42.2 | 34.54,72.42 33.32,73.64 D2.2 | 34.54,72.42 33.17,71.04 33.17,67.31 C37.2 33.25,67.23 33.25,60.45 D1.2 | R10.2 R11.2 | R11.2 | R10.2 | D1.2 33.32,60.3 33.86,59.77 36.98,59.77 PS5V.1 37.06,59.84 37.97,59.84 41.71,63.58 46.28,63.58 R11.2 | D1.2 33.78,59.69 33.17,59.08 33.17,54.66 C36.2 33.17,54.51 33.17,46.36
  Top 0.254: JP-DEBUG.1 3.23,87.66 4.67,87.66 7.57,90.55 R16.1 7.64,90.7 11.3,90.7 C46.2 11.46,90.7 12.67,91.92 12.67,94.36 12.45,94.59 9.7,94.59 8.18,96.11 7.57,96.11 D3.1 7.95,96.19 7.95,98.63 5.74,100.84 5.74,106.02 H4.B2,8 | IC7.1 17.25,70.43 17.25,67.39 17.17,67.31 TP8.TP 12.06,67.31 | IC8.1 17.25,53.98 17.25,50.93 17.17,50.85 TP6.TP 17.17,50.7 17.17,46.36 | C4.1 55.73,69.22 55.73,64.19 C5.1 55.8,64.03 v55.8,62.51 | IC4.6 50.39,54.59 53.52,54.59 54.59,53.52 C3.1 54.66,53.37 54.66,52.76 55.8,51.61 55.8,46.36 | v61.29,47.19 60.53,47.19 59.69,46.36
  Bottom 0.254: 85.9,39.65 90.48,39.65 91.39,38.73 AP-IGN.2 | 85.9,39.65 81.33,39.65 FAN2.1 | 85.9,27.3 81.64,27.3 81.33,27 FAN1.1 | 85.9,27.3 ODROID.2 | 85.9,27.3 85.9,39.65 | v81.64,76.53 87.35,76.53 88.27,75.62 TEMP.3 | OK-PWR-IGN.P$3 59.08,85.14 59.08,87.66 OK-PWR-IGN.P$5 61.59,91.47 59.16,93.9 OK-PWR-N2_DISP.P$3 OK-PWR-N2_DISP.P$2 56.41,93.9 53.98,91.47 OK-PWR-IGN.P$8 | v61.29,47.19 66.02,51.92 U$4.A 65.94,51.99 55.8,62.13 v55.8,62.51 | 31.75,29.82 31.12,29.82 | 12.06,46.36 12.06,50.16 | 4.98,78.11 4.98,85.52 3.23,87.27 3.23,87.58 JP-DEBUG.1 | 5.13,13.34 5.13,4.44 H1.B2,8 | H4.B2,8 6.12,105.64 14.58,105.64 16.03,104.19 17.09,104.19 X1.3 | 47.65,13.34 47.65,5.13 BATT.2
  other vias: 4.45,56.52 4.45,59.06 6.98,59.06 6.98,56.52 1.91,76.83 4.45,76.83 6.98,76.83 9.53,76.83 1.91,74.3 4.45,74.3 6.98,74.3 9.53,74.3 1.91,71.75 4.45,71.75 6.98,71.75 9.53,71.75 1.91,69.22 4.45,69.22 6.98,69.22 9.53,69.22 1.91,66.67 4.45,66.67 6.98,66.67 9.53,66.67 1.91,64.14 4.45,64.14 6.98,64.14 9.53,64.14 1.91,61.59 4.45,61.59 6.98,61.59 9.53,61.59 1.91,59.06 9.53,59.06 1.91,56.52 9.53,56.52 1.91,53.98 4.45,53.98 6.98,53.98 9.53,53.98 1.91,51.44 4.45,51.44 6.98,51.44 9.53,51.44 21.59,28.58 49.53,28.58 19.05,23.5 21.59,23.5 24.13,23.5 19.05,20.96 21.59,20.96 24.13,20.96 19.05,18.41 21.59,18.41 24.13,18.41 19.05,15.88 21.59,15.88 24.13,15.88 46.99,23.5 49.53,23.5 52.07,23.5 46.99,20.96 49.53,20.96 52.07,20.96 46.99,18.41 49.53,18.41 52.07,18.41 46.99,15.88 49.53,15.88 52.07,15.88 21.59,26.04 49.53,26.04
  pour Top (no thermals): 19.69,27.3 23.5,27.3 23.5,24.77 25.4,24.77 25.4,13.97 17.78,13.97 17.78,24.77 19.69,24.77
  pour Top (no thermals): 47.62,27.3 47.62,24.77 45.72,24.77 45.72,13.97 53.34,13.97 53.34,24.77 51.43,24.77 51.43,27.3
  pour Top (no thermals): -0.64,78.11 12.06,78.11 12.06,50.16 -0.64,50.16
  pour Bottom (no thermals): -1.27,78.11 12.06,78.11 12.06,50.16 -1.27,50.16
  pour Top (no thermals): 3.81,46.36 31.12,46.36 31.12,13.34 3.17,13.34 3.17,46.36
  pour Top (no thermals): 31.75,46.36 59.69,46.36 59.69,13.34 31.75,13.34
  pour Bottom (no thermals): 3.17,46.36 31.12,46.36 31.12,13.34 3.17,13.34
  pour Bottom (no thermals): 31.75,46.36 59.69,46.36 59.69,13.34 31.75,13.34
IGN
  Top 0.508: R2.1 88.27,52.07 IGN-IN.2 91.47,48.72 91.47,43.84 IGN-IN.1 91.54,43.61 91.54,41.4 93.68,39.27 93.68,35.92 91.62,33.86 AP-IGN.1 91.39,33.63 89.1,31.34 89.1,10.08 83.24,4.22 83.24,3.68 R4.2
IGN-IN  (via drill 0.35)
  Top 0.381: v74.47,59.31 81.71,52.07 R2.2
  Bottom 0.381: v74.47,59.31 74.47,63.42 58.17,79.73 58.17,80.87 53.98,85.06 OK-PWR-IGN.P$1
IGN-LED
  Top 0.508: IGN.2 79.43,6.81 82.86,6.81 83.16,6.5 R4.1
INA-0X40-ADDR0
  Top 0.152: IC4.2 45.29,55.88 50.16,60.76 R10.1
INA-0X40-ADDR1
  Top 0.152: IC4.1 44.98,57.17 44.98,59.39 46.35,60.76 R11.1
L1
  Top 0.381: IC5.2 46.58,30.81 45.82,30.81 45.29,31.34 45.29,35.23 46.66,36.6 46.66,37.44 L2.1 46.58,37.59 43.84,37.59 C19.2
L1-2
  Top 0.381: IC6.2 18.69,30.81 19.3,30.81 19.38,30.89 19.53,30.89 19.61,30.96 19.91,30.96 19.99,31.04 19.99,35.38 18.77,36.6 18.77,37.44 L4.1 18.62,37.59 C34.2
L1-F
  Top 0.381: IC5.20 52.45,31.57 52.45,37.44 L2.2 52.6,37.52 52.91,37.52 54.28,38.89 57.1,38.89 C20.2
L1-F2
  Top 0.381: IC6.20 24.56,31.57 24.56,37.36 24.49,37.44 L4.2 24.71,37.44 24.94,37.44 26.39,38.89 29.21,38.89 C35.2
MCP-OSC1
  Top 0.152: C5.2 58.62,64.19 62.13,64.19 62.2,64.26 Q1.1 62.28,64.26 64.64,66.62 67.01,66.62 IC1.8
MCP-OSC2
  Top 0.152: C4.2 62.13,69.22 62.2,69.14 Q1.2 62.28,69.06 63.35,68 67.01,68 IC1.7
MCP-RESET
  Top 0.152: R3.2 80.49,74.32 76.45,74.32 IC1.17
MCP-TJA-RX
  Top 0.152: IC2.4 72.87,58.47 73.1,58.47 73.86,59.23 73.86,66.17 68.61,71.42 68.61,75.62 68.07,76.15 66.09,76.15 65.86,75.92 65.86,75.16 66.7,74.32 67.01,74.32 IC1.2
MCP-TJA-TX
  Top 0.152: IC2.1 72.8,62.28 72.8,66.78 68.3,71.27 68.3,74.7 67.46,75.54 67.08,75.54 IC1.1
MODE-SELECT
  Top 0.152: 47.54,27.49 47.88,27.15 47.88,26.77 48.49,26.16 48.49,25.63 49.1,25.02 50.77,25.02 51.38,25.63 52.45,25.63 IC5.11 52.45,25.7 52.45,26.24 IC5.12 52.53,26.31 53.52,26.31 53.67,26.47 53.67,27.46 53.52,27.61 52.53,27.61 IC5.14 | 47.54,27.49 47.42,27.61 46.66,27.61 IC5.7 | 47.54,27.49 47.8,27.76 47.8,30.28 48.56,31.04 48.56,39.27 48.26,39.57 43.38,39.57 42.39,38.58 42.39,37.9 40.03,35.54 40.03,34.85 C17.1
MODE-SELECT-2
  Top 0.152: 19.46,27.53 18.69,27.53 IC6.7 | 19.46,27.53 19.91,27.08 19.91,26.77 20.6,26.09 20.6,25.63 21.21,25.02 22.89,25.02 23.5,25.63 24.49,25.63 IC6.11 24.56,25.7 24.56,26.24 IC6.12 24.56,26.31 25.55,26.31 25.78,26.54 25.78,27.38 25.55,27.61 24.56,27.61 IC6.14 | C32.1 12.06,35.54 14.5,37.97 14.5,38.58 15.49,39.57 20.37,39.57 20.68,39.27 20.68,31.12 19.91,30.35 19.91,27.84 19.69,27.61 19.53,27.61 19.46,27.53
N$25
  Top 0.152: D3.4 7.26,98.09 6.88,98.09 5.51,96.72 4.67,96.72 J1.1
NRESET  (via drill 0.35)
  Top 0.152: 41.17,95.35 42.77,95.35 43.76,96.34 R15.1 43.84,96.42 46.24,98.82 | 41.17,95.35 40.18,95.35 37.52,92.69 37.52,91.92 IC11.40 | v81.64,19.46 78.44,19.46 S2.3 | 46.24,98.82 v47.65,100.23 | 41.17,95.35 41.17,97.26 40.03,98.4 40.03,99.16 C43.2 | 46.24,98.82 44.53,100.53 35.84,100.53 29.74,106.63 24.79,106.63 X1.10
  Bottom 0.152: v81.64,19.46 86.13,19.46 93.52,26.85 93.52,77.6 70.89,100.23 v47.65,100.23
ODROID-3V3
  Top 0.152: R1.1 83.77,107.47 81.1,107.47 80.65,107.92 JP-N2.1
ODROID-3V3$2
  Top 0.152: R1.2 83.77,104.57 81.26,104.57 77.37,100.69 71.2,100.69 62.43,91.92 62.43,85.98 61.59,85.14 OK-PWR-IGN.P$4
ODROID-PWR-BTN
  Top 0.152: JP-N2.11 66.93,106.93 66.93,105.49 65.86,104.42 65.71,104.42 60.38,99.08 59.08,99.08 OK-PWR-N2_DISP.P$6
OE
  Top 0.152: IC3.10 53.29,74.55 52.91,74.93 R5.2
POWER-GOOD/1  (via drill 0.35)
  Top 0.152: v51.16,30.81 51.16,28.52 51.46,28.22 52.45,28.22 IC5.15 | v53.75,30.28 54.59,31.12 R14.1
  Bottom 0.152: v51.16,30.81 53.21,30.81 v53.75,30.28
POWER-GOOD/2  (via drill 0.35)
  Top 0.152: v23.19,30.89 23.27,30.81 23.27,28.45 23.5,28.22 24.49,28.22 IC6.15 | v25.78,32.03 26.7,31.12 R9.1
  Bottom 0.152: v23.19,30.89 24.64,30.89 v25.78,32.03
PS3V3-LED
  Top 0.152: PS3V3.2 39.8,72.34 39.8,68.83 39.57,68.61 R23.1
PS5V-LED
  Top 0.381: PS5V.2 40.41,59.69 40.41,56.11 40.18,55.88 R22.1
PS12V-1-LED
  Top 0.152: PS12V-1.2 37.9,43.16 37.9,42.62 36.07,40.79 33.78,40.79 33.48,40.49 33.48,38.28 33.78,37.97 35.76,37.97 37.13,39.34 37.59,39.34 R20.1
PS12V-2-LED
  Top 0.381: PS12V-2.2 9.93,43.23 9.32,43.23 8.94,43.61 8.1,43.61 7.42,44.3 5.59,44.3 5.36,44.07 5.36,38.28 5.74,37.9 7.87,37.9 8.26,38.28 8.26,38.51 9.09,39.34 9.63,39.34 R21.1
PWM1-D2  (via drill 0.35)
  Top 0.152: v80.11,49.4 76.3,53.21 64.19,53.21 48.95,68.45 48.95,74.62 39.19,84.38 36.68,84.38 36.45,84.15 36.45,83.46 IC11.19
  Bottom 0.152: v80.11,49.4 80.11,35.76 81.26,34.62 FAN1.4
PWM2-D3
  Top 0.152: IC11.20 36.98,83.39 36.98,81.25 48.64,69.6 48.64,68.3 64.03,52.91 75.69,52.91 81.26,47.35 FAN2.4
SHUNT+
  Top 0.508: IC4.8 50.39,57.17 52.6,57.17 54.59,59.16 R7.2
SPI-CS-5V
  Top 0.152: IC1.16 76.07,73.03 70.74,78.36 64.87,78.36 62.89,80.34 62.05,80.34 IC3.20
SPI-INT-5V
  Top 0.152: IC3.15 62.05,77.14 68.15,77.14 74.93,70.36 74.93,69.14 76.07,68 76.38,68 IC1.12
SPI-MISO-5V  (via drill 0.35)
  Top 0.152: v60.68,78.28 60.68,78.44 61.29,79.05 61.98,79.05 IC3.18 | v74.17,67.39 77.45,67.39 77.6,67.54 77.6,70.89 76.76,71.73 76.45,71.73 IC1.15
  Bottom 0.152: v60.68,78.28 63.27,78.28 v74.17,67.39
SPI-MOSI-5V
  Top 0.152: IC3.17 62.05,78.44 64.34,78.44 64.72,78.05 68.53,78.05 76.07,70.51 76.38,70.51 IC1.14
SPI-SCK-5V
  Top 0.152: IC1.13 76.07,69.22 75.23,70.05 75.23,70.51 68,77.75 62.05,77.75 IC3.16
SWCLK
  Top 0.152: IC11.45 34.92,91.92 34.92,92.61 32.18,95.35 29.59,95.35 20.68,104.27 20.68,104.57 19.61,105.64 18.16,105.64 17.17,106.63 X1.4
SWDIO  (via drill 0.35)
  Top 0.152: v19.61,102.82 27.38,95.05 32.03,95.05 34.39,92.69 34.39,91.92 IC11.46
  Bottom 0.152: v19.61,102.82 18.16,104.27 18.16,104.57 17.09,105.64 15.65,105.64 X1.2
TH  (via drill 0.35)
  Top 0.152: 59.69,5.13 54.66,5.13 STATUS.3 | 73.03,5.13 68,5.13 BT-STA.3 67.92,5.13 62.2,5.13 | v78.82,5.13 79.96,5.13 IGN.3 | 73.03,5.13 v74.02,5.13 | 73.03,5.13 BT-ACT.3 | 62.2,5.13 59.69,5.13 | 59.69,5.13 ACTIVITY.3 | v8.26,41.55 PS12V-2.3 | PS5V.3 38.73,59 v37.9,58.17 37.97,58.17 38.35,57.78 38.35,54.89 38.32,54.85 | 38.32,54.85 36.22,52.76 36.22,42.55 PS12V-1.3 | v38.05,60.91 38.05,71.73 PS3V3.3 | 62.2,5.13 62.2,50.85 55.65,57.4 53.52,57.4 52.6,56.49 49.48,56.49 45.74,52.76 40.41,52.76 38.32,54.85
  Bottom 0.152: v74.02,5.13 v78.82,5.13 | v8.26,41.55 24.87,58.17 v37.9,58.17 38.05,58.32 v38.05,60.91
USB-GND
  Top 0.254: J1.5 4.67,93.98 7.11,93.98 7.57,93.52 R16.2 7.72,93.45 11.38,93.45 C46.1
USB_DM  (via drill 0.35)
  Top 0.152: v9.78,97.26 9.25,97.79 9.25,98.09 D3.3 | v6.96,97.26 6.5,97.26 5.28,96.04 4.67,96.04 J1.2 | v38.73,88.8 38.81,88.88 40.41,88.88 IC11.33
  Bottom 0.152: v6.96,97.26 v9.78,97.26 29.9,97.26 38.35,88.8 v38.73,88.8
USB_DP  (via drill 0.35)
  Top 0.152: J1.3 4.6,95.35 4.06,95.35 3.68,95.73 3.68,98.25 2.77,99.16 2.77,107.24 4.52,108.99 6.88,108.99 8.64,107.24 8.64,97.71 9.17,97.18 9.17,96.19 D3.2 9.25,96.11 v9.93,95.43 | v36.3,89.94 36.83,89.41 40.41,89.41 IC11.34
  Bottom 0.152: v36.3,89.94 15.42,89.94 v9.93,95.43
VBAT-F
  Top 0.508: C9.1 C10.1 35.69,25.63 35.69,28.98 C11.1 38.96,29.21 39.12,29.06 C12.+ 39.42,28.98 39.5,29.06 41.86,29.06 C13.1 | IC5.6 46.58,28.3 46.58,28.83 IC5.5 | IC5.4 46.58,29.52 46.58,29.13 IC5.5 | IC5.5 46.35,28.91 46.05,28.91 45.9,29.06 45.36,29.06 45.29,28.98 42.09,28.98 C13.1 | L1.2 41.33,26.39 41.33,27.84 41.4,27.91 41.4,28.83 C13.1
VBAT-F1
  Top 0.508: C24.1 7.72,21.59 7.72,25.4 C25.1 7.72,25.63 7.72,28.98 C26.1 11.3,29.21 C27.+ 11.46,28.98 11.53,29.06 13.97,29.06 C28.1 | IC6.6 18.69,28.3 18.69,28.83 IC6.5 | IC6.4 18.69,29.52 18.69,29.13 IC6.5 | IC6.5 18.47,28.91 18.09,28.91 17.93,29.06 17.55,29.06 17.32,28.83 14.35,28.83 14.2,28.98 C28.1 | L3.2 13.36,26.39 13.36,27.76 13.44,27.84 13.44,28.83 C28.1
VDDANA-F  (via drill 0.35)
  Top 0.152: C39.1 21.13,93.98 L8.2 22.58,90.17 23.72,89.03 26.7,89.03 | v29.21,88.11 30.66,88.11 30.89,87.88 IC11.6 | 26.7,89.03 26.7,89.48 27.38,90.17 C38.1 | 26.7,89.03 v26.7,88.72
  Bottom 0.152: v29.21,88.11 27.31,88.11 v26.7,88.72
VDDCORE
  Top 0.152: IC11.43 35.99,91.92 35.99,96.19 36.14,96.34 C55.1